# Altium schematic sheet MotorDrive.SchDoc
size A; SheetNumber: 3; SheetTotal: 3
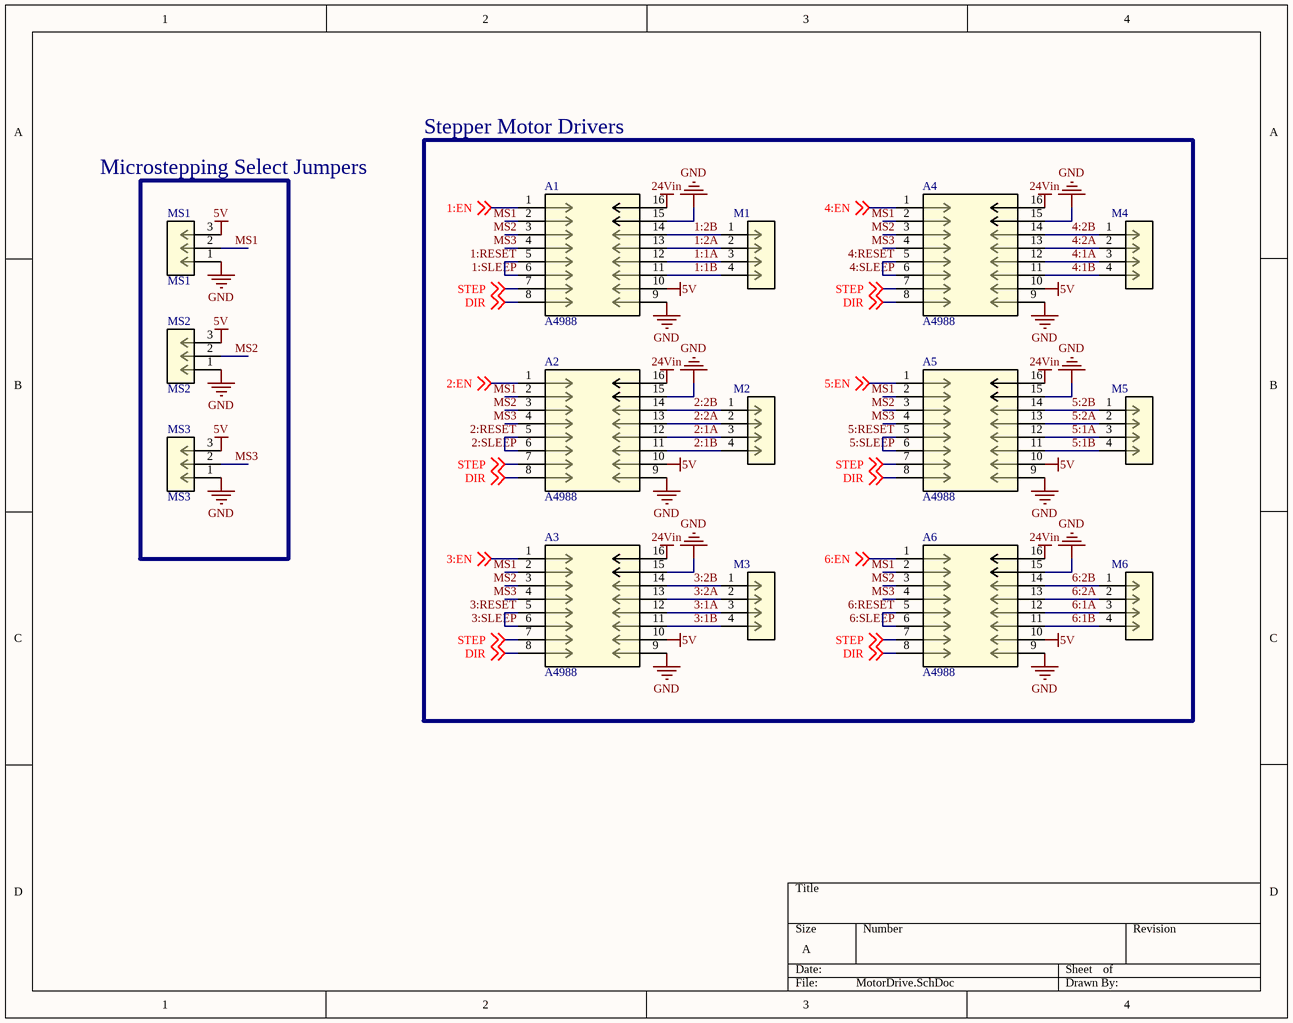
[diagram p0: MotorDrive.SchDoc]

## Parts
A1  A4988  [2x8A4988]
A2  A4988  [2x8A4988]
A3  A4988  [2x8A4988]
A4  A4988  [2x8A4988]
A5  A4988  [2x8A4988]
A6  A4988  [2x8A4988]
M1  (no value)  [1x4StanHeader]
M2  (no value)  [1x4StanHeader]
M3  (no value)  [1x4StanHeader]
M4  (no value)  [1x4StanHeader]
M5  (no value)  [1x4StanHeader]
M6  (no value)  [1x4StanHeader]
MS1  MS1  [1x3StanHeader]
MS2  MS2  [1x3StanHeader]
MS3  MS3  [1x3StanHeader]

## Blocks framed on the sheet
Stepper Motor Drivers: A1-A6 M1-M6

## Nets
5V: A1.10 A2.10 A3.10 A4.10 A5.10 A6.10 MS1.3 MS2.3 MS3.3
24Vin: A1.16 A2.16 A3.16 A4.16 A5.16 A6.16
GND: A1.9 A1.15 A2.9 A2.15 A3.9 A3.15 A4.9 A4.15 A5.9 A5.15 A6.9 A6.15 MS1.1 MS2.1 MS3.1
1:1A: A1.12 M1.3
1:1B: A1.11 M1.4
1:2A: A1.13 M1.2
1:2B: A1.14 M1.1
1:EN: A1.1 ; off-sheet 1:EN
1:RESET: A1.5 A1.6  [also labelled 1:SLEEP]
2:1A: A2.12 M2.3
2:1B: A2.11 M2.4
2:2A: A2.13 M2.2
2:2B: A2.14 M2.1
2:EN: A2.1 ; off-sheet 2:EN
2:RESET: A2.5 A2.6  [also labelled 2:SLEEP]
3:1A: A3.12 M3.3
3:1B: A3.11 M3.4
3:2A: A3.13 M3.2
3:2B: A3.14 M3.1
3:EN: A3.1 ; off-sheet 3:EN
3:RESET: A3.5 A3.6  [also labelled 3:SLEEP]
4:1A: A4.12 M4.3
4:1B: A4.11 M4.4
4:2A: A4.13 M4.2
4:2B: A4.14 M4.1
4:EN: A4.1 ; off-sheet 4:EN
4:RESET: A4.5 A4.6  [also labelled 4:SLEEP]
5:1A: A5.12 M5.3
5:1B: A5.11 M5.4
5:2A: A5.13 M5.2
5:2B: A5.14 M5.1
5:EN: A5.1 ; off-sheet 5:EN
5:RESET: A5.5 A5.6  [also labelled 5:SLEEP]
6:1A: A6.12 M6.3
6:1B: A6.11 M6.4
6:2A: A6.13 M6.2
6:2B: A6.14 M6.1
6:EN: A6.1 ; off-sheet 6:EN
6:RESET: A6.5 A6.6  [also labelled 6:SLEEP]
DIR: A1.8 A2.8 A3.8 A4.8 A5.8 A6.8 ; off-sheet DIR
MS1: A1.2 A2.2 A3.2 A4.2 A5.2 A6.2 MS1.2
MS2: A1.3 A2.3 A3.3 A4.3 A5.3 A6.3 MS2.2
MS3: A1.4 A2.4 A3.4 A4.4 A5.4 A6.4 MS3.2
STEP: A1.7 A2.7 A3.7 A4.7 A5.7 A6.7 ; off-sheet STEP

## Notes on the sheet
- Microstepping Select Jumpers

## Library data of the parts
A1-A6 = 8x2_A4988: No Description Available; Mfr_Name: TE Connectivity; Manufacturer_Part_Number: 1-2199298-9; Type: DEV; Copyright: Copyright (C) 2022 Ultra Librarian. All rights reserved.; RefDes: RefDes
M1-M6 = 4x1_J: No Description Available; Manufacturer_Part_Number: 5-826631-0; Vendor: TE Connectivity; Built_By: EMA_UL_Team; SourceLibrary: Tyco_2012-04-26; Copyright: Copyright (C) 2018 Accelerated Designs. All rights reserved; RefDes: RefDes; Type: DEV
MS1-MS3 = 3x1_J: No Description Available; Manufacturer_Part_Number: 5-826631-0; Vendor: TE Connectivity; Built_By: EMA_UL_Team; SourceLibrary: Tyco_2012-04-26; Copyright: Copyright (C) 2018 Accelerated Designs. All rights reserved; RefDes: RefDes; Type: DEV